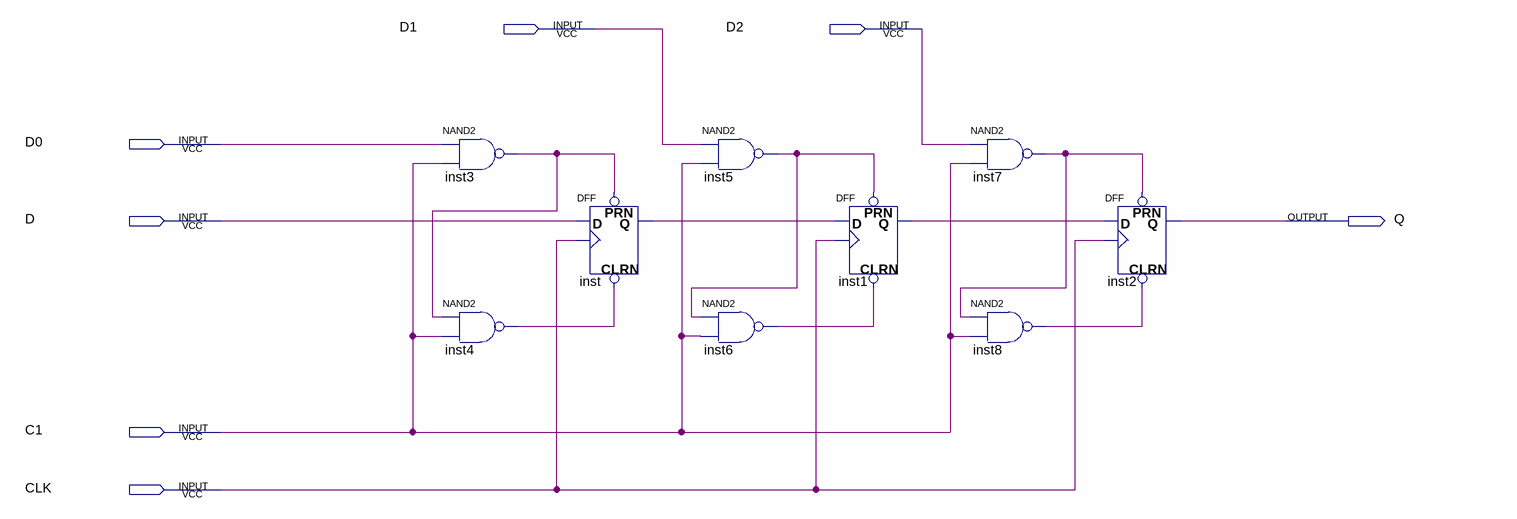
[diagram p0: schematic sheet]
// Quartus schematic ParSeqReg.bdf as structural Verilog: 9 symbols, 7 pins
module ParSeqReg (
  input  D1,
  input  D2,
  input  D0,
  input  D,
  input  C1,
  input  CLK,
  output Q
);

  wire inst1_q, inst3_out, inst4_out, inst5_out, inst6_out, inst7_out, inst8_out, inst_q;

  nand inst3 (inst3_out, D0, C1);
  nand inst4 (inst4_out, inst3_out, C1);
  DFF inst (.CLRN(inst4_out), .CLK(CLK), .D(D), .PRN(inst3_out), .Q(inst_q));
  nand inst5 (inst5_out, D1, C1);
  nand inst6 (inst6_out, inst5_out, C1);
  DFF inst1 (.CLRN(inst6_out), .CLK(CLK), .D(inst_q), .PRN(inst5_out), .Q(inst1_q));
  nand inst7 (inst7_out, D2, C1);
  nand inst8 (inst8_out, inst7_out, C1);
  DFF inst2 (.CLRN(inst8_out), .CLK(CLK), .D(inst1_q), .PRN(inst7_out), .Q(Q));
endmodule
